# Altium project LimeSDR-XTRX_1v4.PrjPcb (part 4 of 8)

## Sheet 08_FPGA.SchDoc: FPGA
size A3; Organization: Lime Microsystems; Address1: Surrey Tech Centre; Address2: Guildford GU2 7YG; Address3: Surrey; Address4: United Kingdom; Revision: v1.4; SheetNumber: 8; SheetTotal: 11
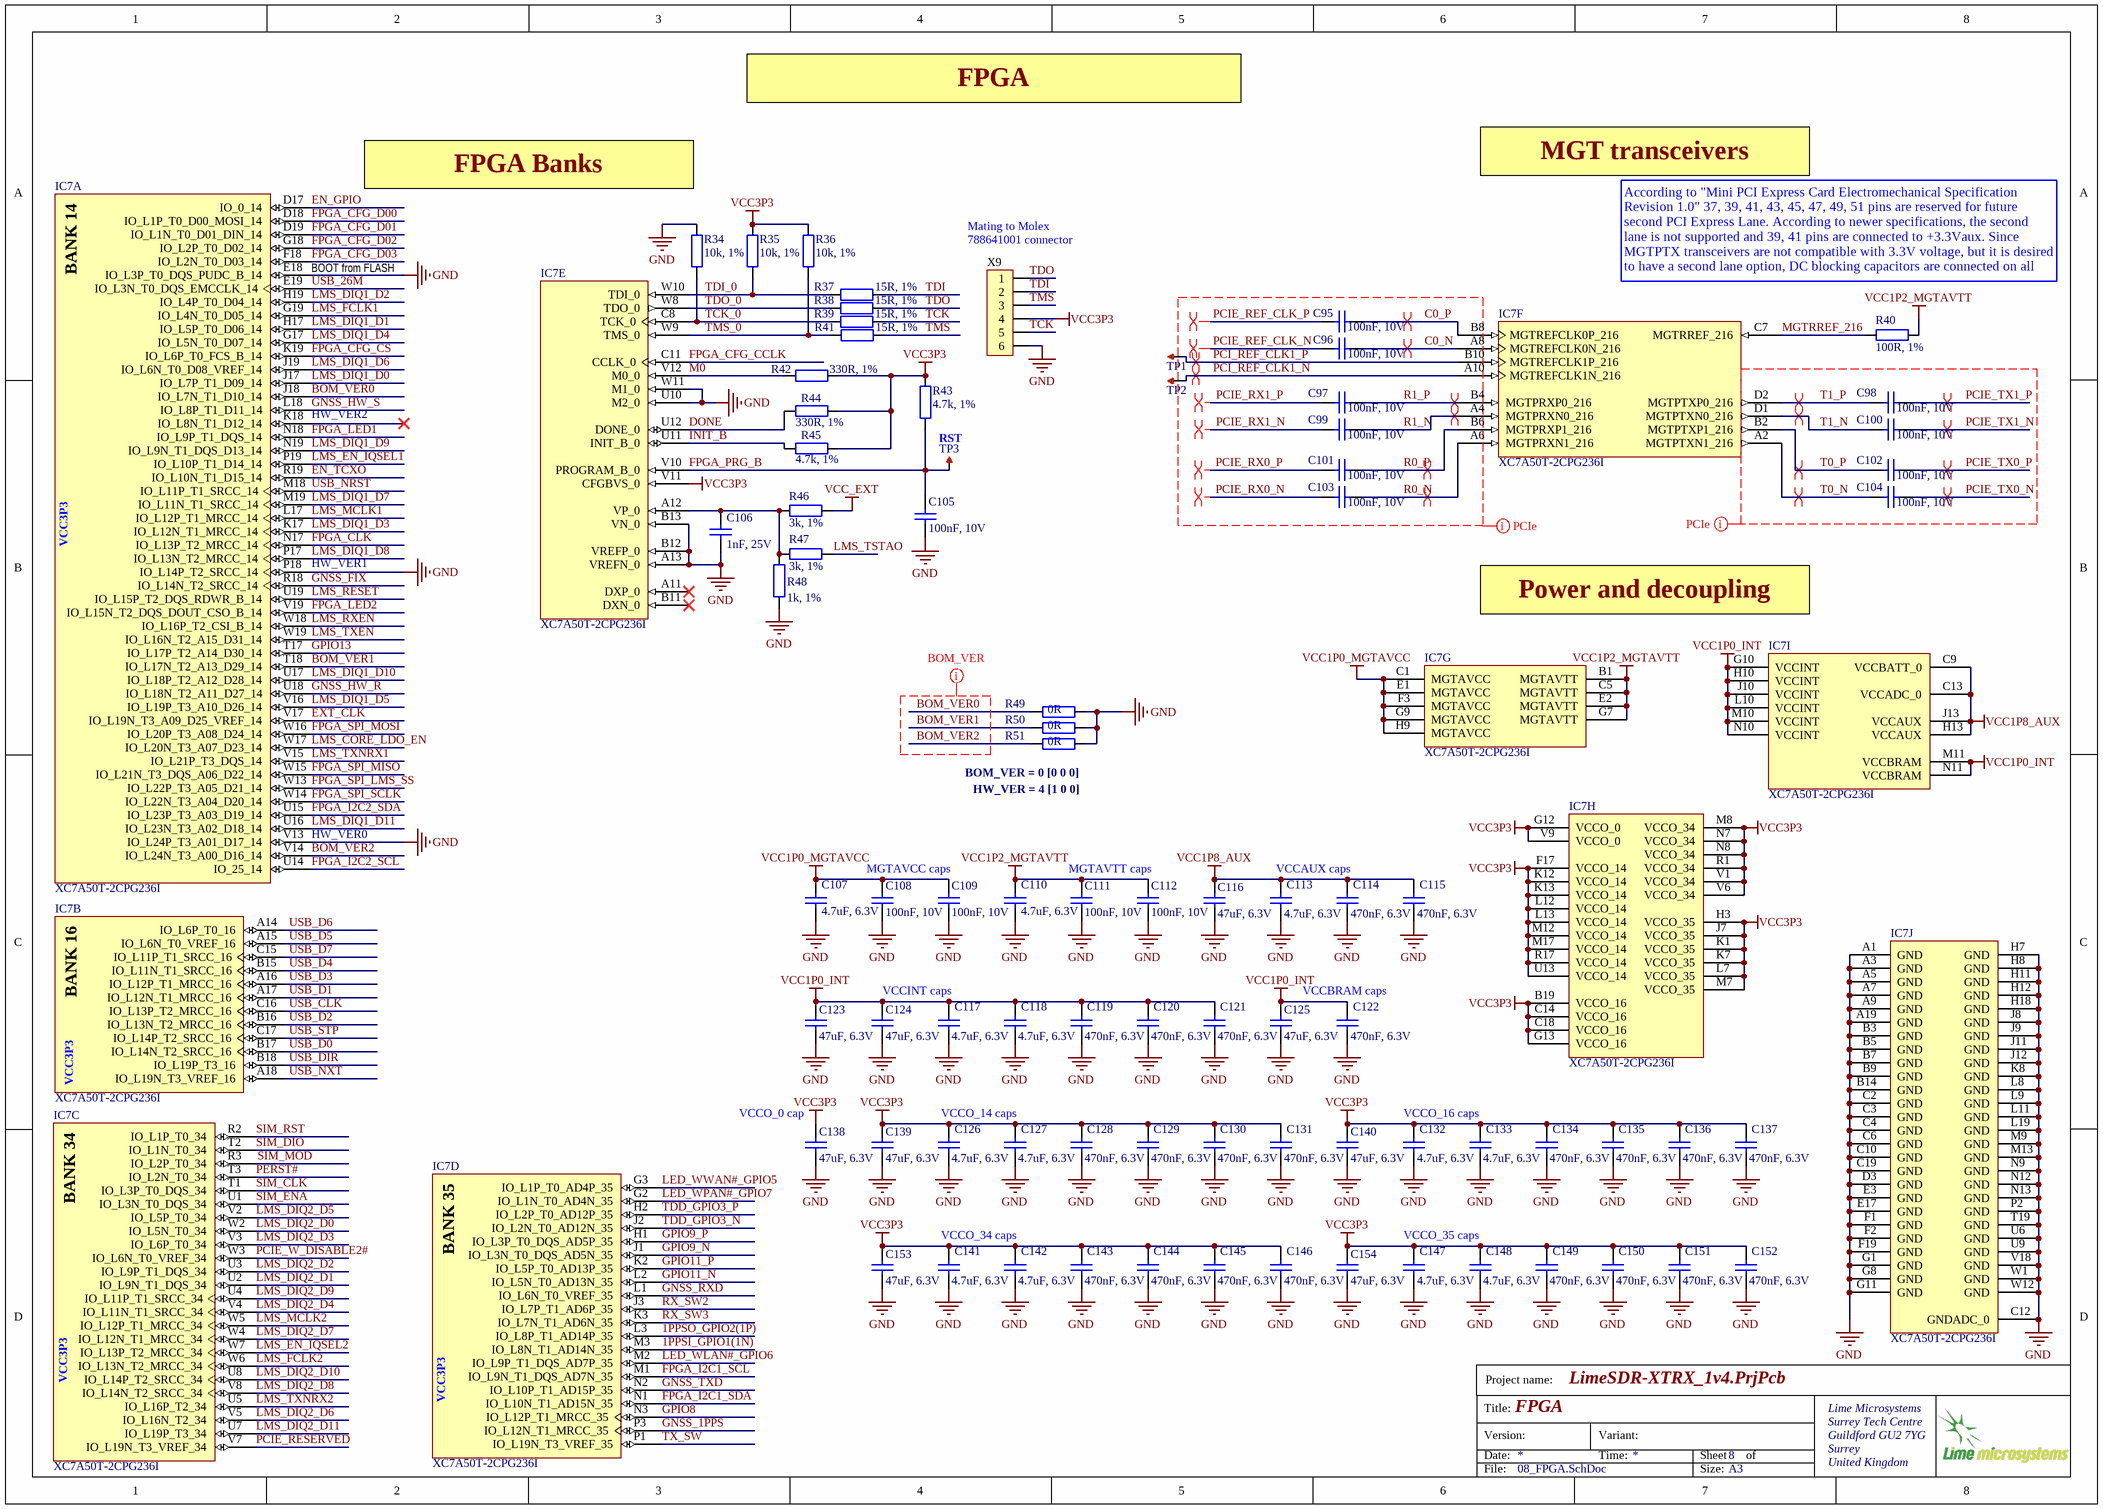
[diagram p7: 08_FPGA.SchDoc]

### Parts
C95  100nF, 10V  [CAP0201]
C96  100nF, 10V  [CAP0201]
C97  100nF, 10V  [CAP0201]
C98  100nF, 10V  [CAP0201]
C99  100nF, 10V  [CAP0201]
C100  100nF, 10V  [CAP0201]
C101  100nF, 10V  [CAP0201]
C102  100nF, 10V  [CAP0201]
C103  100nF, 10V  [CAP0201]
C104  100nF, 10V  [CAP0201]
C105  100nF, 10V  [CAP0201]
C106  1nF, 25V  [CAP0201]
C107  4.7uF, 6.3V  [CAP0402]
C108  100nF, 10V  [CAP0201]
C109  100nF, 10V  [CAP0201]
C110  4.7uF, 6.3V  [CAP0402]
C111  100nF, 10V  [CAP0201]
C112  100nF, 10V  [CAP0201]
C113  4.7uF, 6.3V  [CAP0402]
C114  470nF, 6.3V  [CAP0201]
C115  470nF, 6.3V  [CAP0201]
C116  47uF, 6.3V  [CAP0603]
C117  4.7uF, 6.3V  [CAP0402]
C118  4.7uF, 6.3V  [CAP0402]
C119  470nF, 6.3V  [CAP0201]
C120  470nF, 6.3V  [CAP0201]
C121  470nF, 6.3V  [CAP0201]
C122  470nF, 6.3V  [CAP0201]
C123  47uF, 6.3V  [CAP0603]
C124  47uF, 6.3V  [CAP0603]
C125  47uF, 6.3V  [CAP0603]
C126  4.7uF, 6.3V  [CAP0402]
C127  4.7uF, 6.3V  [CAP0402]
C128  470nF, 6.3V  [CAP0201]
C129  470nF, 6.3V  [CAP0201]
C130  470nF, 6.3V  [CAP0201]
C131  470nF, 6.3V  [CAP0201]
C132  4.7uF, 6.3V  [CAP0402]
C133  4.7uF, 6.3V  [CAP0402]
C134  470nF, 6.3V  [CAP0201]
C135  470nF, 6.3V  [CAP0201]
C136  470nF, 6.3V  [CAP0201]
C137  470nF, 6.3V  [CAP0201]
C138  47uF, 6.3V  [CAP0603]
C139  47uF, 6.3V  [CAP0603]
C140  47uF, 6.3V  [CAP0603]
C141  4.7uF, 6.3V  [CAP0402]
C142  4.7uF, 6.3V  [CAP0402]
C143  470nF, 6.3V  [CAP0201]
C144  470nF, 6.3V  [CAP0201]
C145  470nF, 6.3V  [CAP0201]
C146  470nF, 6.3V  [CAP0201]
C147  4.7uF, 6.3V  [CAP0402]
C148  4.7uF, 6.3V  [CAP0402]
C149  470nF, 6.3V  [CAP0201]
C150  470nF, 6.3V  [CAP0201]
C151  470nF, 6.3V  [CAP0201]
C152  470nF, 6.3V  [CAP0201]
C153  47uF, 6.3V  [CAP0603]
C154  47uF, 6.3V  [CAP0603]
IC7  XC7A50T-2CPG236I  [XC7A35T-2CPG236]  (parts A,B,C,D,E,F,G,H,I,J of 10)
R34  10k, 1%  [RES0201]
R35  10k, 1%  [RES0201]
R36  10k, 1%  [RES0201]
R37  15R, 1%  [RES0201]
R38  15R, 1%  [RES0201]
R39  15R, 1%  [RES0201]
R40  100R, 1%  [RES0201]
R41  15R, 1%  [RES0201]
R42  330R, 1%  [RES0201]
R43  4.7k, 1%  [RES0201]
R44  330R, 1%  [RES0201]
R45  4.7k, 1%  [RES0201]
R46  3k, 1%  [RES0201]
R47  3k, 1%  [RES0201]
R48  1k, 1%  [RES0201]
R49  0R  [RES0201]
R50  0R  [RES0201]
R51  0R  [RES0201]
TP1  TESTPOINT_PAD  [TP_PAD_1MM]  (value not drawn)  (no BOM)
TP2  TESTPOINT_PAD  [TP_PAD_1MM]  (value not drawn)  (no BOM)
TP3  TESTPOINT_PAD  [TP_PAD_1MM]  (value not drawn)  (no BOM)
X9  Molex 0788641001  [Molex_0788641001_spring_contacts]  (value not drawn)

### Nets
GND: C105.2 C106.2 C107.1 C108.2 C109.2 C110.1 C111.2 C112.2 C113.1 C114.2 C115.2 C116.1 C117.1 C118.1 C119.2 C120.2 C121.2 C122.2 C123.1 C124.1 C125.1 C126.1 C127.1 C128.2 C129.2 C130.2 C131.2 C132.1 C133.1 C134.2 C135.2 C136.2 C137.2 C138.1 C139.1 C140.1 C141.1 C142.1 C143.2 C144.2 C145.2 C146.2 C147.1 C148.1 C149.2 C150.2 C151.2 C152.2 C153.1 C154.1 IC7.A1(GND) IC7.A3(GND) IC7.A5(GND) IC7.A7(GND) IC7.A9(GND) IC7.A13(VREFN_0) IC7.A19(GND) IC7.B3(GND) IC7.B5(GND) IC7.B7(GND) IC7.B9(GND) IC7.B12(VREFP_0) IC7.B13(VN_0) IC7.B14(GND) IC7.C2(GND) IC7.C3(GND) IC7.C4(GND) IC7.C6(GND) IC7.C10(GND) IC7.C12(GNDADC_0) IC7.C19(GND) IC7.D3(GND) IC7.E3(GND) IC7.E17(GND) IC7.E18(IO_L3P_T0_DQS_PUDC_B_14) IC7.F1(GND) IC7.F2(GND) IC7.F19(GND) IC7.G1(GND) IC7.G8(GND) IC7.G11(GND) IC7.H7(GND) IC7.H8(GND) IC7.H11(GND) IC7.H12(GND) IC7.H18(GND) IC7.J8(GND) IC7.J9(GND) IC7.J11(GND) IC7.J12(GND) IC7.K8(GND) IC7.L8(GND) IC7.L9(GND) IC7.L11(GND) IC7.L19(GND) IC7.M9(GND) IC7.M13(GND) IC7.N9(GND) IC7.N12(GND) IC7.N13(GND) IC7.P2(GND) IC7.P18(IO_L14P_T2_SRCC_14) IC7.T19(GND) IC7.U6(GND) IC7.U9(GND) IC7.U10(M2_0) IC7.V13(IO_L24P_T3_A01_D17_14) IC7.V18(GND) IC7.W1(GND) IC7.W11(M1_0) IC7.W12(GND) R34.1 R48.2 R49.1 R50.1 R51.1 X9.6
VCC1P0_INT: C117.2 C118.2 C119.1 C120.1 C121.1 C122.1 C123.2 C124.2 C125.2 IC7.G10(VCCINT) IC7.H10(VCCINT) IC7.J10(VCCINT) IC7.L10(VCCINT) IC7.M10(VCCINT) IC7.M11(VCCBRAM) IC7.N10(VCCINT) IC7.N11(VCCBRAM)
VCC1P0_MGTAVCC: C107.2 C108.1 C109.1 IC7.C1(MGTAVCC) IC7.E1(MGTAVCC) IC7.F3(MGTAVCC) IC7.G9(MGTAVCC) IC7.H9(MGTAVCC)
VCC1P2_MGTAVTT: C110.2 C111.1 C112.1 IC7.B1(MGTAVTT) IC7.C5(MGTAVTT) IC7.E2(MGTAVTT) IC7.G7(MGTAVTT) R40.1
VCC1P8_AUX: C113.2 C114.1 C115.1 C116.2 IC7.C9(VCCBATT_0) IC7.C13(VCCADC_0) IC7.H13(VCCAUX) IC7.J13(VCCAUX)
VCC3P3: C126.2 C127.2 C128.1 C129.1 C130.1 C131.1 C132.2 C133.2 C134.1 C135.1 C136.1 C137.1 C138.2 C139.2 C140.2 C141.2 C142.2 C143.1 C144.1 C145.1 C146.1 C147.2 C148.2 C149.1 C150.1 C151.1 C152.1 C153.2 C154.2 IC7.B19(VCCO_16) IC7.C14(VCCO_16) IC7.C18(VCCO_16) IC7.F17(VCCO_14) IC7.G12(VCCO_0) IC7.G13(VCCO_16) IC7.H3(VCCO_35) IC7.J7(VCCO_35) IC7.K1(VCCO_35) IC7.K7(VCCO_35) IC7.K12(VCCO_14) IC7.K13(VCCO_14) IC7.L7(VCCO_35) IC7.L12(VCCO_14) IC7.L13(VCCO_14) IC7.M7(VCCO_35) IC7.M8(VCCO_34) IC7.M12(VCCO_14) IC7.M17(VCCO_14) IC7.N7(VCCO_34) IC7.N8(VCCO_34) IC7.R1(VCCO_34) IC7.R17(VCCO_14) IC7.U13(VCCO_14) IC7.V1(VCCO_34) IC7.V6(VCCO_34) IC7.V9(VCCO_0) IC7.V11(CFGBVS_0) R35.1 R36.1 R42.1 R43.1 R44.1 R45.1 X9.4
VCC_EXT: R46.2
1PPSI_GPIO1(1N): IC7.M3(IO_L8N_T1_AD14N_35)
1PPSO_GPIO2(1P): IC7.L3(IO_L8P_T1_AD14P_35)
BOM_VER0: IC7.J18(IO_L7N_T1_D10_14) R49.2
BOM_VER1: IC7.T18(IO_L17N_T2_A13_D29_14) R50.2
BOM_VER2: IC7.V14(IO_L24N_T3_A00_D16_14) R51.2
C0_N: C96.2 IC7.A8(MGTREFCLK0N_216)
C0_P: C95.2 IC7.B8(MGTREFCLK0P_216)
DONE: IC7.U12(DONE_0) R44.2
EN_GPIO: IC7.D17(IO_0_14)
EN_TCXO: IC7.R19(IO_L10N_T1_D15_14)
EXT_CLK: IC7.V17(IO_L19N_T3_A09_D25_VREF_14)
FPGA_CFG_CCLK: IC7.C11(CCLK_0)
FPGA_CFG_CS: IC7.K19(IO_L6P_T0_FCS_B_14)
FPGA_CFG_D00: IC7.D18(IO_L1P_T0_D00_MOSI_14)
FPGA_CFG_D01: IC7.D19(IO_L1N_T0_D01_DIN_14)
FPGA_CFG_D02: IC7.G18(IO_L2P_T0_D02_14)
FPGA_CFG_D03: IC7.F18(IO_L2N_T0_D03_14)
FPGA_CLK: IC7.N17(IO_L13P_T2_MRCC_14)
FPGA_I2C1_SCL: IC7.M1(IO_L9N_T1_DQS_AD7N_35)
FPGA_I2C1_SDA: IC7.N1(IO_L10N_T1_AD15N_35)
FPGA_I2C2_SCL: IC7.U14(IO_25_14)
FPGA_I2C2_SDA: IC7.U15(IO_L23P_T3_A03_D19_14)
FPGA_LED1: IC7.N18(IO_L9P_T1_DQS_14)
FPGA_LED2: IC7.V19(IO_L15N_T2_DQS_DOUT_CSO_B_14)
FPGA_PRG_B: C105.1 IC7.V10(PROGRAM_B_0) R43.2 TP3.1
FPGA_SPI_LMS_SS: IC7.W13(IO_L22P_T3_A05_D21_14)
FPGA_SPI_MISO: IC7.W15(IO_L21N_T3_DQS_A06_D22_14)
FPGA_SPI_MOSI: IC7.W16(IO_L20P_T3_A08_D24_14)
FPGA_SPI_SCLK: IC7.W14(IO_L22N_T3_A04_D20_14)
GNSS_1PPS: IC7.P3(IO_L12N_T1_MRCC_35)
GNSS_FIX: IC7.R18(IO_L14N_T2_SRCC_14)
GNSS_HW_R: IC7.U18(IO_L18N_T2_A11_D27_14)
GNSS_HW_S: IC7.L18(IO_L8P_T1_D11_14)
GNSS_RXD: IC7.L1(IO_L6N_T0_VREF_35)
GNSS_TXD: IC7.N2(IO_L10P_T1_AD15P_35)
GPIO8: IC7.N3(IO_L12P_T1_MRCC_35)
GPIO9_N: IC7.J1(IO_L3N_T0_DQS_AD5N_35)
GPIO9_P: IC7.H1(IO_L3P_T0_DQS_AD5P_35)
GPIO11_N: IC7.L2(IO_L5N_T0_AD13N_35)
GPIO11_P: IC7.K2(IO_L5P_T0_AD13P_35)
GPIO13: IC7.T17(IO_L17P_T2_A14_D30_14)
INIT_B: IC7.U11(INIT_B_0) R45.2
LED_WLAN#_GPIO6: IC7.M2(IO_L9P_T1_DQS_AD7P_35)
LED_WPAN#_GPIO7: IC7.G2(IO_L1N_T0_AD4N_35)
LED_WWAN#_GPIO5: IC7.G3(IO_L1P_T0_AD4P_35)
LMS_CORE_LDO_EN: IC7.W17(IO_L20N_T3_A07_D23_14)
LMS_DIQ1_D0: IC7.J17(IO_L7P_T1_D09_14)
LMS_DIQ1_D1: IC7.H17(IO_L5P_T0_D06_14)
LMS_DIQ1_D2: IC7.H19(IO_L4P_T0_D04_14)
LMS_DIQ1_D3: IC7.K17(IO_L12N_T1_MRCC_14)
LMS_DIQ1_D4: IC7.G17(IO_L5N_T0_D07_14)
LMS_DIQ1_D5: IC7.V16(IO_L19P_T3_A10_D26_14)
LMS_DIQ1_D6: IC7.J19(IO_L6N_T0_D08_VREF_14)
LMS_DIQ1_D7: IC7.M19(IO_L11N_T1_SRCC_14)
LMS_DIQ1_D8: IC7.P17(IO_L13N_T2_MRCC_14)
LMS_DIQ1_D9: IC7.N19(IO_L9N_T1_DQS_D13_14)
LMS_DIQ1_D10: IC7.U17(IO_L18P_T2_A12_D28_14)
LMS_DIQ1_D11: IC7.U16(IO_L23N_T3_A02_D18_14)
LMS_DIQ2_D0: IC7.W2(IO_L5N_T0_34)
LMS_DIQ2_D1: IC7.U2(IO_L9N_T1_DQS_34)
LMS_DIQ2_D2: IC7.U3(IO_L9P_T1_DQS_34)
LMS_DIQ2_D3: IC7.V3(IO_L6P_T0_34)
LMS_DIQ2_D4: IC7.V4(IO_L11N_T1_SRCC_34)
LMS_DIQ2_D5: IC7.V2(IO_L5P_T0_34)
LMS_DIQ2_D6: IC7.V5(IO_L16N_T2_34)
LMS_DIQ2_D7: IC7.W4(IO_L12N_T1_MRCC_34)
LMS_DIQ2_D8: IC7.V8(IO_L14N_T2_SRCC_34)
LMS_DIQ2_D9: IC7.U4(IO_L11P_T1_SRCC_34)
LMS_DIQ2_D10: IC7.U8(IO_L14P_T2_SRCC_34)
LMS_DIQ2_D11: IC7.U7(IO_L19P_T3_34)
LMS_EN_IQSEL1: IC7.P19(IO_L10P_T1_D14_14)
LMS_EN_IQSEL2: IC7.W7(IO_L13P_T2_MRCC_34)
LMS_FCLK1: IC7.G19(IO_L4N_T0_D05_14)
LMS_FCLK2: IC7.W6(IO_L13N_T2_MRCC_34)
LMS_MCLK1: IC7.L17(IO_L12P_T1_MRCC_14)
LMS_MCLK2: IC7.W5(IO_L12P_T1_MRCC_34)
LMS_RESET: IC7.U19(IO_L15P_T2_DQS_RDWR_B_14)
LMS_RXEN: IC7.W18(IO_L16P_T2_CSI_B_14)
LMS_TSTAO: R47.2
LMS_TXEN: IC7.W19(IO_L16N_T2_A15_D31_14)
LMS_TXNRX1: IC7.V15(IO_L21P_T3_DQS_14)
LMS_TXNRX2: IC7.U5(IO_L16P_T2_34)
M0: IC7.V12(M0_0) R42.2
MGTRREF_216: IC7.C7(MGTRREF_216) R40.2
PCI_REF_CLK1_N: IC7.A10(MGTREFCLK1N_216) TP2.1
PCI_REF_CLK1_P: IC7.B10(MGTREFCLK1P_216) TP1.1
PCIE_REF_CLK_N: C96.1
PCIE_REF_CLK_P: C95.1
PCIE_RESERVED: IC7.V7(IO_L19N_T3_VREF_34)
PCIE_RX0_N: C103.1
PCIE_RX0_P: C101.1
PCIE_RX1_N: C99.1
PCIE_RX1_P: C97.1
PCIE_TX0_N: C104.2
PCIE_TX0_P: C102.2
PCIE_TX1_N: C100.2
PCIE_TX1_P: C98.2
PCIE_W_DISABLE2#: IC7.W3(IO_L6N_T0_VREF_34)
PERST#: IC7.T3(IO_L2N_T0_34)
R0_N: C103.2 IC7.A6(MGTPRXN1_216)
R0_P: C101.2 IC7.B6(MGTPRXP1_216)
R1_N: C99.2 IC7.A4(MGTPRXN0_216)
R1_P: C97.2 IC7.B4(MGTPRXP0_216)
RX_SW2: IC7.J3(IO_L7P_T1_AD6P_35)
RX_SW3: IC7.K3(IO_L7N_T1_AD6N_35)
SIM_CLK: IC7.T1(IO_L3P_T0_DQS_34)
SIM_DIO: IC7.T2(IO_L1N_T0_34)
SIM_ENA: IC7.U1(IO_L3N_T0_DQS_34)
SIM_MOD: IC7.R3(IO_L2P_T0_34)
SIM_RST: IC7.R2(IO_L1P_T0_34)
T0_N: C104.1 IC7.A2(MGTPTXN1_216)
T0_P: C102.1 IC7.B2(MGTPTXP1_216)
T1_N: C100.1 IC7.D1(MGTPTXN0_216)
T1_P: C98.1 IC7.D2(MGTPTXP0_216)
TCK: R39.1 X9.5
TCK_0: IC7.C8(TCK_0) R34.2 R39.2
TDD_GPIO3_N: IC7.J2(IO_L2N_T0_AD12N_35)
TDD_GPIO3_P: IC7.H2(IO_L2P_T0_AD12P_35)
TDI: R37.1 X9.2
TDI_0: IC7.W10(TDI_0) R35.2 R37.2
TDO: R38.1 X9.1
TDO_0: IC7.W8(TDO_0) R38.2
TMS: R41.1 X9.3
TMS_0: IC7.W9(TMS_0) R36.2 R41.2
TX_SW: IC7.P1(IO_L19N_T3_VREF_35)
USB_26M: IC7.E19(IO_L3N_T0_DQS_EMCCLK_14)
USB_CLK: IC7.C16(IO_L13P_T2_MRCC_16)
USB_D0: IC7.B17(IO_L14N_T2_SRCC_16)
USB_D1: IC7.A17(IO_L12N_T1_MRCC_16)
USB_D2: IC7.B16(IO_L13N_T2_MRCC_16)
USB_D3: IC7.A16(IO_L12P_T1_MRCC_16)
USB_D4: IC7.B15(IO_L11N_T1_SRCC_16)
USB_D5: IC7.A15(IO_L6N_T0_VREF_16)
USB_D6: IC7.A14(IO_L6P_T0_16)
USB_D7: IC7.C15(IO_L11P_T1_SRCC_16)
USB_DIR: IC7.B18(IO_L19P_T3_16)
USB_NRST: IC7.M18(IO_L11P_T1_SRCC_14)
USB_NXT: IC7.A18(IO_L19N_T3_VREF_16)
USB_STP: IC7.C17(IO_L14P_T2_SRCC_16)
NetC106_1: C106.1 IC7.A12(VP_0) R46.1 R47.1 R48.1

Not connected (* = marked no-connect by the designer): IC7 A11(DXP_0)* B11(DXN_0)* K18(IO_L8N_T1_D12_14)*

### Layout directives
differential pair: C0_N, C0_P, PCI_REF_CLK1_N, PCI_REF_CLK1_P, PCIE_REF_CLK_N, PCIE_REF_CLK_P, PCIE_RX0_N, PCIE_RX0_P, PCIE_RX1_N, PCIE_RX1_P, PCIE_TX0_N, PCIE_TX0_P, PCIE_TX1_N, PCIE_TX1_P, R0_N, R0_P, R1_N, R1_P, T0_N, T0_P, T1_N, T1_P
net class PCIe: C0_N, C0_P, PCI_REF_CLK1_N, PCI_REF_CLK1_P, PCIE_REF_CLK_N, PCIE_REF_CLK_P, PCIE_RX0_N, PCIE_RX0_P, PCIE_RX1_N, PCIE_RX1_P, PCIE_TX0_N, PCIE_TX0_P, PCIE_TX1_N, PCIE_TX1_P, R0_N, R0_P, R1_N, R1_P, T0_N, T0_P, T1_N, T1_P
net class BOM_VER: BOM_VER0, BOM_VER1, BOM_VER2

### Notes on the sheet
- FPGA
- MGT transceivers
- (near R34) FPGA Banks
- (near X9) Mating to Molex 788641001 connector
- (near IC7) BOOT from FLASH
- According to "Mini PCI Express Card Electromechanical Specification Revision 1.0" 37, 39, 41, 43, 45, 47, 49, 51 pins are reserved for future second PCI Express Lane. According to newer specifications, the second lane is not supported and 39, 41 pins are connected to +3.3Vaux. Since MGTPTX transceivers are not compatible with 3.3V voltage, but it is desired to have a second lane option, DC blocking capacitors are connected on all TX lines.
- (near IC7) HW_VER2
- RST
- VCC3P3
- (near IC7) HW_VER1
- (near IC7) Power and decoupling
- (near R51) BOM_VER = 0 [0 0 0]
- (near IC7) HW_VER0
- HW_VER = 4 [1 0 0]
- MGTAVCC caps
- MGTAVTT caps
- VCCAUX caps
- VCCINT caps
- VCCBRAM caps
- (near C138) VCCO_0 cap
- VCCO_14 caps
- VCCO_16 caps
- VCCO_34 caps
- VCCO_35 caps
- Project name:
- Title:
- Version:
- Date:
- Variant:
- Time:
- Sheet
- of
- File:
- Size:
- A3
- (in symbol XC7A35T-2CPG236, part A) BANK 14
- (in symbol XC7A35T-2CPG236, part B) BANK 16
- (in symbol XC7A35T-2CPG236, part C) BANK 34
- (in symbol XC7A35T-2CPG236, part D) BANK 35

### Library data of the parts
C95-C97 C99 C101 C103 C105 C108 C109 C111 C112 = Cap_0402: Part Description: 0.1 µF ±20% 10V Ceramic Capacitor X5R 0201 (0603 Metric); Manufacturer: Samsung; Manufacturer Part Number 1: CL03A104MP3NNNC; Tolerance: 20%; Value: 100nF, 10V; Capacitance: 100nF; Case/Package: 0201; Case Code (Imperial): 0201; Case Code (Metric): 0603; ComponentLink5Description: https://datasheet.ciiva.com/25788/cl03a104mp3nnnc-25788272.pdf?src-supplier=Digi-Key; ComponentLink5URL: https://datasheet.ciiva.com/25788/cl03a104mp3nnnc-25788272.pdf?src-supplier=Digi-Key; Length: 0.024inch; Max Operating Temperature: 85°C; Min Operating Temperature: -55°C; Mount: Surface Mount; Package Quantity: 1; Packaging: Tape and Reel; Pricing 1: 1=0,10000, 10=0,03000, 50=0,01640, 100=0,01330, 500=0,00950, 1000=0,00747, 2500=0,00679, 5000=0,00625 (USD); RoHS: Yes; RoHS Compliant: Yes; Series: CL; Stock 1: 3817176; Supplier 1: Digi-Key; Supplier Part Number 1: 1276-1321-1-ND; Thickness: 0.013inch; Voltage Rating (DC): 10V; Voltage Rating: 10V; Width: 0.012inch
C98 C100 C102 C104 = Cap_0402: Manufacturer: Samsung; Manufacturer Part Number 1: CL03A104MP3NNNC; Part Description: 0.1 µF ±20% 10V Ceramic Capacitor X5R 0201 (0603 Metric); Tolerance: 20%; ComponentLink5Description: https://datasheet.ciiva.com/25788/cl03a104mp3nnnc-25788272.pdf?src-supplier=Digi-Key; ComponentLink5URL: https://datasheet.ciiva.com/25788/cl03a104mp3nnnc-25788272.pdf?src-supplier=Digi-Key; Capacitance: 100nF; Case/Package: 0201; Case Code (Imperial): 0201; Case Code (Metric): 0603; Length: 0.024inch; Max Operating Temperature: 85°C; Min Operating Temperature: -55°C; Mount: Surface Mount; Package Quantity: 1; Packaging: Tape and Reel; Pricing 1: 1=0,10000, 10=0,03000, 50=0,01640, 100=0,01330, 500=0,00950, 1000=0,00747, 2500=0,00679, 5000=0,00625 (USD); RoHS: Yes; RoHS Compliant: Yes; Series: CL; Stock 1: 3817176; Supplier 1: Digi-Key; Supplier Part Number 1: 1276-1321-1-ND; Thickness: 0.013inch; Value: 100nF, 10V; Voltage Rating (DC): 10V; Voltage Rating: 10V; Width: 0.012inch
C106 = Cap_0402: Manufacturer Part Number 1: C0603X7R1E102K030BA; Manufacturer: TDK Corporation; Part Description: 1000pF ±10% 25V X7R Ceramic Capacitor -55°C ~ 125°C Surface Mount, MLCC 0201 (0603 Metric) 0.024" L x 0.012" W (0.60mm x 0.30mm); Temperature Coefficient: X7R; Tolerance: ±10%; Capacitance: 1000pF; Value: 1nF, 25V; Supplier 1: Digi-Key; Supplier Part Number 1: 445-7275-1-ND; Voltage - Rated: 25V; Features: -; Package / Case: 0201 (0603 Metric); Lead Spacing: -; Mounting Type: Surface Mount, MLCC; Lead Style: -; Height - Seated (Max): -; Operating Temperature: -55°C ~ 125°C; Size / Dimension: 0.024" L x 0.012" W (0.60mm x 0.30mm); Applications: General Purpose; Ratings: -; Thickness (Max): 0.013" (0.33mm); RoHS: RoHS Compliant; Packaging: Cut Tape (CT); Category: Capacitors
C107 C110 C113 C117 C118 C126 C127 C132 C133 C141 C142 C147 C148 = Cap_0402: Manufacturer: Murata Electronics North America; Manufacturer Part Number 1: GRM155R60J475ME87D; Part Description: 4.7µF ±20% 6.3V X5R Ceramic Capacitor -55°C ~ 85°C Surface Mount, MLCC 0402 (1005 Metric) 0.039" L x 0.020" W (1.00mm x 0.50mm); Tolerance: ±20%; Capacitance: 4.7µF; Temperature Coefficient: X5R; Lead Style: -; Ratings: -; Height - Seated (Max): -; Thickness (Max): 0.022" (0.55mm); Voltage - Rated: 6.3V; Packaging: Cut Tape (CT); Lead Spacing: -; Category: Capacitors; Supplier Part Number 1: 490-5408-1-ND; Applications: General Purpose; Operating Temperature: -55°C ~ 85°C; Mounting Type: Surface Mount, MLCC; Features: Derating Recommended; RoHS: RoHS Compliant; Supplier 1: Digi-Key; Package / Case: 0402 (1005 Metric); Size / Dimension: 0.039" L x 0.020" W (1.00mm x 0.50mm); Value: 4.7uF, 6.3V
C114 C115 C119-C122 C128-C131 C134-C137 C143-C146 C149-C152 = Cap_0402: Manufacturer: Murata; Manufacturer Part Number 1: GRM033R60J474KE90D; Part Description: 0.47 µF ±10% 6.3V Ceramic Capacitor X5R 0201 (0603 Metric); Tolerance: 10%; Dielectric: X5R; Value: 470nF, 6.3V; Supplier 1: Digi-Key; Supplier Part Number 1: 490-10409-1-ND; Stock 1: 1562532; Pricing 1: 1=0,10000, 10=0,06000, 50=0,03280, 100=0,02670, 500=0,01908, 1000=0,01500, 2500=0,01364, 5000=0,01254 (USD); RoHS: Yes; Mount: Surface Mount; Case/Package: 0201; Case Code (Metric): 0603; Case Code (Imperial): 0201; Weight: 1.2E-05oz; Min Operating Temperature: -55°C; Max Operating Temperature: 85°C; Packaging: Tape and Reel; Capacitance: 470nF; Voltage Rating: 6.3V; Termination: SMD/SMT; Voltage Rating (DC): 6.3V; Package Quantity: 15000; Length: 0.6mm; Width: 0.012inch; Height: 0.3mm; Thickness: 0.013inch; Depth: 0.3mm; Lead Free: Lead Free; RoHS Compliant: Yes; ComponentLink1URL: http://www.farnell.com/datasheets/2867834.pdf?src-supplier=Farnell; ComponentLink1Description: http://www.farnell.com/datasheets/2867834.pdf?src-supplier=Farnell; ComponentLink2URL: http://www.mouser.com/ds/2/281/c02e-2905.pdf?src-supplier=Mouser; ComponentLink2Description: http://www.mouser.com/ds/2/281/c02e-2905.pdf?src-supplier=Mouser; ComponentLink3URL: http://www.farnell.com/datasheets/2867834.pdf?src-supplier=Element14; ComponentLink3Description: http://www.farnell.com/datasheets/2867834.pdf?src-supplier=Element14; ComponentLink4URL: http://search.murata.co.jp/Ceramy/image/img/A01X/G101/ENG/GRM033R60J474KE90-01.pdf?src-supplier=Digi-Key; ComponentLink4Description: http://search.murata.co.jp/Ceramy/image/img/A01X/G101/ENG/GRM033R60J474KE90-01.pdf?src-supplier=Digi-Key; ComponentLink5URL: http://www.farnell.com/datasheets/2867834.pdf?src-supplier=Newark; ComponentLink5Description: http://www.farnell.com/datasheets/2867834.pdf?src-supplier=Newark
C116 C123-C125 C138-C140 C153 C154 = Cap_0603: Part Description: 47 µF ±20% 6.3V Ceramic Capacitor X5R 0603 (1608 Metric); Manufacturer: Murata; Manufacturer Part Number 1: GRM188R60J476ME15D; Tolerance: 20%; Dielectric: X5R; Value: 47uF, 6.3V; Supplier 1: Digi-Key; Supplier Part Number 1: 490-13247-1-ND; Stock 1: 731453; Pricing 1: 1=0,45000, 10=0,31900, 50=0,24120, 100=0,21000, 500=0,15556, 1000=0,13223 (USD); RoHS: Yes; Mount: Surface Mount; Case/Package: 0603; Case Code (Metric): 1608; Case Code (Imperial): 0603; Min Operating Temperature: -55°C; Max Operating Temperature: 85°C; Packaging: Tape and Reel; Capacitance: 47uF; Voltage Rating: 6.3V; Voltage Rating (DC): 6.3V; Length: 0.063inch; Width: 0.031inch; Thickness: 0.039inch; RoHS Compliant: Yes; ComponentLink1URL: http://search.murata.co.jp/Ceramy/image/img/A01X/G101/ENG/GRM188R60J476ME15-01.pdf?src-supplier=Digi-Key; ComponentLink1Description: http://search.murata.co.jp/Ceramy/image/img/A01X/G101/ENG/GRM188R60J476ME15-01.pdf?src-supplier=Digi-Key; ComponentLink2URL: https://www.murata.com/~/media/webrenewal/support/library/catalog/products/capacitor/mlcc/c02e.ashx?la=en-us&src-supplier=Digi-Key; ComponentLink2Description: https://www.murata.com/~/media/webrenewal/support/library/catalog/products/capacitor/mlcc/c02e.ashx?la=en-us&src-supplier=Digi-Key
IC7 = XC7A35T-2CPG236: Artix-7 FPGA; Part Description: Artix-7 Field Programmable Gate Array (FPGA) IC 106 2764800 52160 238-LFBGA, CSPBGA; Manufacturer: Xilinx; Propagation Delay: 0.85ns; Speed Grade: 2; Number of Logic Blocks (LABs): 4075; Number of Logic Elements/Cells: 52160; RAM Size: 2764800b; Number of I/Os: 106; Number of Registers: 652; Min Supply Voltage: 950mV; Max Supply Voltage: 1.05V; ComponentLink1Description: Manufacturer URL; ComponentLink1URL: http://www.xilinx.com/; ComponentLink2Description: Datasheet; ComponentLink2URL: http://www.xilinx.com/support/documentation/data_sheets/ds180_7Series_Overview.pdf; ComponentLink3Description: Package Specification; ComponentLink3URL: http://www.xilinx.com/support/documentation/user_guides/ug475_7Series_Pkg_Pinout.pdf; ComponentLink4Description: DC and Switching Characteristics; ComponentLink4URL: http://www.xilinx.com/support/documentation/data_sheets/ds181_Artix_7_Data_Sheet.pdf; ComponentLink5Description: Package File; ComponentLink5URL: http://www.xilinx.com/support/packagefiles/a7packages/xc7a200tsbg484pkg.txt; ComponentLink6Description: Packaging and Pinout; ComponentLink6URL: http://www.xilinx.com/support/documentation/user_guides/ug475_7Series_Pkg_Pinout.pdf; ComponentLink7URL: http://www.farnell.com/datasheets/2553941.pdf?src-supplier=Farnell; ComponentLink7Description: http://www.farnell.com/datasheets/2553941.pdf?src-supplier=Farnell; ComponentLink8URL: http://www.xilinx.com/support/documentation/data_sheets/ds181_Artix_7_Data_Sheet.pdf?src-supplier=Avnet; ComponentLink8Description: http://www.xilinx.com/support/documentation/data_sheets/ds181_Artix_7_Data_Sheet.pdf?src-supplier=Avnet; ComponentLink9URL: https://www.xilinx.com/support/documentation/data_sheets/ds180_7Series_Overview.pdf?src-supplier=Digi-Key; ComponentLink9Description: https://www.xilinx.com/support/documentation/data_sheets/ds180_7Series_Overview.pdf?src-supplier=Digi-Key; Supplier 1: Digi-Key; Supplier Part Number 1: 122-2181-ND; Manufacturer Part Number 1: XC7A50T-2CPG236I; Stock 1: 0; RoHS: Yes; Mount: Surface Mount; Number of Pins: 236; Contact Plating: Copper,Tin,Silver; Min Operating Temperature: -40°C; Max Operating Temperature: 100°C; Turn-On Delay Time: 0.85ns; RoHS Compliant: Yes
R34-R36 = Res_0402: Manufacturer: Yageo; Manufacturer Part Number 1: RC0201FR-0710KL; Part Description: 10 kOhms ±1% 0.05W, 1/20W Chip Resistor 0201 (0603 Metric) Moisture Resistant Thick Film; Resistance: 10kR; Power Rating: 50mW; Voltage Rating: 25V; Temperature Coefficient: 200ppm/°C; Value: 10k, 1%; ComponentLink1URL: https://datasheet.ciiva.com/5924/1563626-5924912.pdf?src-supplier=Farnell; ComponentLink1Description: https://datasheet.ciiva.com/5924/1563626-5924912.pdf?src-supplier=Farnell; ComponentLink2URL: https://datasheet.ciiva.com/22661/1563626-22661319.pdf?src-supplier=Element14; ComponentLink2Description: https://datasheet.ciiva.com/22661/1563626-22661319.pdf?src-supplier=Element14; Supplier 1: Digi-Key; Supplier Part Number 1: 311-10.0KMCT-ND; Stock 1: 17142315; Pricing 1: 1=0,10000, 10=0,03700, 100=0,01530, 1000=0,00685, 2500=0,00595, 5000=0,00491 (USD); RoHS: Yes; Case/Package: 0201; Number of Pins: 2; Case Code (Imperial): 0201; Case Code (Metric): 0603; Contact Plating: Tin,Matte; Weight: 6E-06oz; Min Operating Temperature: -55°C; Max Operating Temperature: 125°C; Tolerance: 1%; Packaging: Tape and Reel; Package Quantity: 10000; Termination: SMD/SMT; Resistor Type: Thick Film; Number of Terminations: 2; Max Power Dissipation: 50mW; Voltage Rating (DC): 25V; Features: Moisture Resistant; Series: RC; Resistance Tolerance: 1%; Construction: Rectangular; Working Voltage: 25V; Technology: THICK FILM; Length: 0.6mm; Width: 0.012inch; Height: 0.01inch; Depth: 0.3mm; Radiation Hardening: No; Reach SVHC Compliant: Yes; Military Standard: Not; Lead Free: Lead Free; RoHS Compliant: Yes; ComponentLink3URL: https://datasheet.ciiva.com/7660/1421516-7660807.pdf?src-supplier=Element14; ComponentLink3Description: https://datasheet.ciiva.com/7660/1421516-7660807.pdf?src-supplier=Element14; ComponentLink4URL: https://datasheet.ciiva.com/46391/1421516-46391339.pdf?src-supplier=Element14; ComponentLink4Description: https://datasheet.ciiva.com/46391/1421516-46391339.pdf?src-supplier=Element14; ComponentLink5URL: https://datasheet.ciiva.com/2467/pyu-r-int-thick-7-2467110.pdf?src-supplier=Digi-Key; ComponentLink5Description: https://datasheet.ciiva.com/2467/pyu-r-int-thick-7-2467110.pdf?src-supplier=Digi-Key; ComponentLink6URL: https://datasheet.ciiva.com/2467/pyu-r-int-thick-7-2467111.pdf?src-supplier=Digi-Key; ComponentLink6Description: https://datasheet.ciiva.com/2467/pyu-r-int-thick-7-2467111.pdf?src-supplier=Digi-Key; ComponentLink7URL: https://datasheet.ciiva.com/2467/pyu-r-int-thick-7-2467109.pdf?src-supplier=Digi-Key; ComponentLink7Description: https://datasheet.ciiva.com/2467/pyu-r-int-thick-7-2467109.pdf?src-supplier=Digi-Key
R37-R39 R41 = Res_0402: Manufacturer: Yageo; Manufacturer Part Number 1: RC0201FR-0715RL; Part Description: 15 Ohms ±1% 0.05W, 1/20W Chip Resistor 0201 (0603 Metric) Moisture Resistant Thick Film; Power Rating: 50mW; Voltage Rating: 25V; Temperature Coefficient: 200ppm/°C; Value: 15R, 1%; ComponentLink1URL: https://datasheet.ciiva.com/5924/1563626-5924912.pdf?src-supplier=Farnell; ComponentLink1Description: https://datasheet.ciiva.com/5924/1563626-5924912.pdf?src-supplier=Farnell; ComponentLink2URL: https://datasheet.ciiva.com/22661/1563626-22661319.pdf?src-supplier=Element14; ComponentLink2Description: https://datasheet.ciiva.com/22661/1563626-22661319.pdf?src-supplier=Element14; Supplier 1: Digi-Key; Supplier Part Number 1: 311-15.0MCT-ND; Stock 1: 379739; Pricing 1: 1=0,10000, 10=0,03700, 100=0,01530, 1000=0,00685, 2500=0,00595, 5000=0,00491 (USD); RoHS: Yes; Case/Package: 0201; Case Code (Imperial): 0201; Case Code (Metric): 0603; Size Code: 0201; Min Operating Temperature: -55°C; Max Operating Temperature: 125°C; Resistance: 15R; Tolerance: 1%; Packaging: Cut Tape; Package Quantity: 1; Termination: SMD/SMT; Resistor Type: Thick Film; Number of Terminations: 2; Max Power Dissipation: 50mW; Features: Moisture Resistant; Series: RC; Resistance Tolerance: 1%; Length: 0.6mm; Width: 0.3mm; Height: 0.23mm; Lead Free: Lead Free; RoHS Compliant: Yes; ComponentLink3URL: https://datasheet.ciiva.com/7672/1563626-7672202.pdf?src-supplier=Element14; ComponentLink3Description: https://datasheet.ciiva.com/7672/1563626-7672202.pdf?src-supplier=Element14; ComponentLink4URL: https://datasheet.ciiva.com/2493/pyu-r-int-thick-7-2493785.pdf?src-supplier=Digi-Key; ComponentLink4Description: https://datasheet.ciiva.com/2493/pyu-r-int-thick-7-2493785.pdf?src-supplier=Digi-Key; ComponentLink5URL: https://datasheet.ciiva.com/2493/pyu-r-int-thick-7-2493786.pdf?src-supplier=Digi-Key; ComponentLink5Description: https://datasheet.ciiva.com/2493/pyu-r-int-thick-7-2493786.pdf?src-supplier=Digi-Key; ComponentLink6URL: https://datasheet.ciiva.com/2493/pyu-r-int-thick-7-2493784.pdf?src-supplier=Digi-Key; ComponentLink6Description: https://datasheet.ciiva.com/2493/pyu-r-int-thick-7-2493784.pdf?src-supplier=Digi-Key
R40 = Res_0402: Manufacturer: Yageo; Manufacturer Part Number 1: RC0201FR-07100RL; Part Description: 100 Ohms ±1% 0.05W, 1/20W Chip Resistor 0201 (0603 Metric) Moisture Resistant Thick Film; Power Rating: 50mW; Voltage Rating: 25V; Temperature Coefficient: 200ppm/°C; ComponentLink1URL: http://www.yageo.com/documents/recent/PYu-RC_Group_51_RoHS_L_7.pdf; ComponentLink1Description: http://www.yageo.com/documents/recent/PYu-RC_Group_51_RoHS_L_7.pdf; Value: 100R, 1%; Supplier 1: Digi-Key; Supplier Part Number 1: 311-100MCT-ND; Stock 1: 1625377; Pricing 1: 1=0,10000, 10=0,03700, 100=0,01530, 1000=0,00685, 2500=0,00595, 5000=0,00491 (USD); RoHS: Yes; Case/Package: 0201; Case Code (Metric): 0603; Case Code (Imperial): 0201; Contact Plating: Tin,Matte; Size Code: 0201; Min Operating Temperature: -55°C; Max Operating Temperature: 125°C; Resistance: 100R; Tolerance: 1%; Packaging: Cut Tape; Package Quantity: 1; Resistor Type: Thick Film; Number of Terminations: 2; Termination: SMD/SMT; Max Power Dissipation: 50mW; Features: Moisture Resistant; Series: RC; Resistance Tolerance: 1%; Length: 0.024inch; Width: 0.012inch; Height: 0.01inch; Radiation Hardening: No; Lead Free: Lead Free; RoHS Compliant: Yes; ComponentLink2URL: https://datasheet.ciiva.com/2560/pyu-r-int-thick-7-2560866.pdf?src-supplier=Digi-Key; ComponentLink2Description: https://datasheet.ciiva.com/2560/pyu-r-int-thick-7-2560866.pdf?src-supplier=Digi-Key; ComponentLink3URL: https://datasheet.ciiva.com/2560/pyu-r-int-thick-7-2560867.pdf?src-supplier=Digi-Key; ComponentLink3Description: https://datasheet.ciiva.com/2560/pyu-r-int-thick-7-2560867.pdf?src-supplier=Digi-Key; ComponentLink4URL: https://datasheet.ciiva.com/2560/pyu-r-int-thick-7-2560865.pdf?src-supplier=Digi-Key; ComponentLink4Description: https://datasheet.ciiva.com/2560/pyu-r-int-thick-7-2560865.pdf?src-supplier=Digi-Key; ComponentLink5URL: https://datasheet.ciiva.com/8887/pyu-rc0201-51-rohs-l-8-8887865.pdf?src-supplier=Avnet; ComponentLink5Description: https://datasheet.ciiva.com/8887/pyu-rc0201-51-rohs-l-8-8887865.pdf?src-supplier=Avnet
R42 R44 = Res_0402: Part Description: 330 Ohms ±1% 0.05W, 1/20W Chip Resistor 0201 (0603 Metric) Thick Film; Manufacturer: Vishay Dale; Manufacturer Part Number 1: CRCW0201330RFKED; Power Rating: 50mW; Voltage Rating: 30V; Temperature Coefficient: 100ppm/°C; Value: 330R, 1%; Supplier 1: Digi-Key; Supplier Part Number 1: 541-330AABCT-ND; Stock 1: 245078; Pricing 1: 1=0,27000, 10=0,23000, 100=0,08990, 1000=0,03762, 2500=0,03448, 5000=0,03135 (USD); RoHS: Yes; Case/Package: 0201; Weight: 6E-06oz; Case Code (Imperial): 0201; Case Code (Metric): 0603; Contact Plating: Tin; Size Code: 0201; Min Operating Temperature: -55°C; Max Operating Temperature: 155°C; Resistance: 330R; Tolerance: 1%; Packaging: Tape and Reel; Package Quantity: 1; Resistor Type: Thick Film; Number of Terminations: 2; Max Power Dissipation: 50mW; Series: CRCW; Construction: Rectangular; Length: 0.6mm; Width: 0.3mm; Height: 0.011inch; Depth: 0.3mm; Radiation Hardening: No; Military Standard: Not; Lead Free: Lead Free; RoHS Compliant: Yes; ComponentLink1URL: https://datasheet.ciiva.com/8944/crcw0201e3-8944937.pdf?src-supplier=Avnet; ComponentLink1Description: https://datasheet.ciiva.com/8944/crcw0201e3-8944937.pdf?src-supplier=Avnet; ComponentLink2URL: https://datasheet.ciiva.com/2473/crcw0201e3-2473436.pdf?src-supplier=Digi-Key; ComponentLink2Description: https://datasheet.ciiva.com/2473/crcw0201e3-2473436.pdf?src-supplier=Digi-Key; ComponentLink3URL: https://datasheet.ciiva.com/2473/crcw0201e3-2473437.pdf?src-supplier=Digi-Key; ComponentLink3Description: https://datasheet.ciiva.com/2473/crcw0201e3-2473437.pdf?src-supplier=Digi-Key; ComponentLink4URL: https://datasheet.ciiva.com/2473/crcw0201e3-2473438.pdf?src-supplier=Digi-Key; ComponentLink4Description: https://datasheet.ciiva.com/2473/crcw0201e3-2473438.pdf?src-supplier=Digi-Key; ComponentLink5URL: https://datasheet.ciiva.com/16394/dcrcwe3-16394575.pdf?src-supplier=Future+Electronics; ComponentLink5Description: https://datasheet.ciiva.com/16394/dcrcwe3-16394575.pdf?src-supplier=Future+Electronics
R43 R45 = Res_0402: Manufacturer: Yageo; Manufacturer Part Number 1: RC0201FR-074K7L; Part Description: 4.7 kOhms ±1% 0.05W, 1/20W Chip Resistor 0201 (0603 Metric) Moisture Resistant Thick Film; Resistance: 4.7kR; Power Rating: 50mW; Voltage Rating: 25V; Temperature Coefficient: 200ppm/°C; Value: 4.7k, 1%; ComponentLink1URL: https://datasheet.ciiva.com/5924/1563626-5924912.pdf?src-supplier=Farnell; ComponentLink1Description: https://datasheet.ciiva.com/5924/1563626-5924912.pdf?src-supplier=Farnell; ComponentLink2URL: https://datasheet.ciiva.com/22661/1563626-22661319.pdf?src-supplier=Element14; ComponentLink2Description: https://datasheet.ciiva.com/22661/1563626-22661319.pdf?src-supplier=Element14; ComponentLink3URL: https://datasheet.ciiva.com/7672/1563626-7672202.pdf?src-supplier=Element14; ComponentLink3Description: https://datasheet.ciiva.com/7672/1563626-7672202.pdf?src-supplier=Element14; ComponentLink4URL: https://datasheet.ciiva.com/2493/pyu-r-int-thick-7-2493785.pdf?src-supplier=Digi-Key; ComponentLink4Description: https://datasheet.ciiva.com/2493/pyu-r-int-thick-7-2493785.pdf?src-supplier=Digi-Key; ComponentLink5URL: https://datasheet.ciiva.com/2493/pyu-r-int-thick-7-2493786.pdf?src-supplier=Digi-Key; ComponentLink5Description: https://datasheet.ciiva.com/2493/pyu-r-int-thick-7-2493786.pdf?src-supplier=Digi-Key; ComponentLink6URL: https://datasheet.ciiva.com/2493/pyu-r-int-thick-7-2493784.pdf?src-supplier=Digi-Key; ComponentLink6Description: https://datasheet.ciiva.com/2493/pyu-r-int-thick-7-2493784.pdf?src-supplier=Digi-Key; ComponentLink7URL: https://datasheet.ciiva.com/7672/1563626-7672233.pdf?src-supplier=Element14; ComponentLink7Description: https://datasheet.ciiva.com/7672/1563626-7672233.pdf?src-supplier=Element14; ComponentLink8URL: https://datasheet.ciiva.com/2493/pyu-r-int-thick-7-2493812.pdf?src-supplier=Digi-Key; ComponentLink8Description: https://datasheet.ciiva.com/2493/pyu-r-int-thick-7-2493812.pdf?src-supplier=Digi-Key; ComponentLink9URL: https://datasheet.ciiva.com/2493/pyu-r-int-thick-7-2493813.pdf?src-supplier=Digi-Key; ComponentLink9Description: https://datasheet.ciiva.com/2493/pyu-r-int-thick-7-2493813.pdf?src-supplier=Digi-Key; ComponentLink10URL: https://datasheet.ciiva.com/2493/pyu-r-int-thick-7-2493811.pdf?src-supplier=Digi-Key; ComponentLink10Description: https://datasheet.ciiva.com/2493/pyu-r-int-thick-7-2493811.pdf?src-supplier=Digi-Key; ComponentLink11URL: https://datasheet.ciiva.com/8892/pyu-rc0201-51-rohs-l-8-8892942.pdf?src-supplier=Avnet; ComponentLink11Description: https://datasheet.ciiva.com/8892/pyu-rc0201-51-rohs-l-8-8892942.pdf?src-supplier=Avnet; Supplier 1: Digi-Key; Supplier Part Number 1: 311-4.70KMCT-ND; Stock 1: 6149397; Pricing 1: 1=0,10000, 10=0,03700, 100=0,01530, 1000=0,00685, 2500=0,00595, 5000=0,00491 (USD); RoHS: Yes; Case/Package: 0201; Case Code (Metric): 0603; Case Code (Imperial): 0201; Weight: 6E-06oz; Contact Plating: Tin,Matte; Size Code: 0201; Min Operating Temperature: -55°C; Max Operating Temperature: 125°C; Tolerance: 1%; Packaging: Tape and Reel; Package Quantity: 1; Resistor Type: Thick Film; Number of Terminations: 2; Termination: SMD/SMT; Max Power Dissipation: 50mW; Features: Moisture Resistant; Series: RC; Resistance Tolerance: 1%; Construction: Rectangular; Length: 0.6mm; Width: 0.012inch; Height: 0.01inch; Depth: 0.3mm; Radiation Hardening: No; Military Standard: Not; Lead Free: Lead Free; RoHS Compliant: Yes
R46 R47 = Res_0402: Part Description: 3 kOhms ±1% 0.05W, 1/20W Chip Resistor 0201 (0603 Metric) Moisture Resistant Thick Film; Manufacturer: Yageo; Manufacturer Part Number 1: RC0201FR-073KL; Resistance: 3kR; Max Power Dissipation: 50mW; Temperature Coefficient: 200ppm/°C; Value: 3k, 1%; Supplier 1: Digi-Key; Supplier Part Number 1: YAG2656CT-ND; Stock 1: 269780; Pricing 1: 1=0,10000, 10=0,03700, 100=0,01530, 1000=0,00685, 2500=0,00595, 5000=0,00491 (USD); RoHS: Yes; Case/Package: 0201; Case Code (Metric): 0603; Case Code (Imperial): 0201; Min Operating Temperature: -55°C; Max Operating Temperature: 125°C; Packaging: Tape and Reel; Resistor Type: Thick Film; Number of Terminations: 2; Tolerance: 1%; Features: Moisture Resistant; Length: 0.024inch; Width: 0.012inch; Height: 0.01inch; RoHS Compliant: Yes; ComponentLink1URL: http://www.yageo.com/documents/recent/PYu-RC_Group_51_RoHS_L_10.pdf?src-supplier=Digi-Key; ComponentLink1Description: http://www.yageo.com/documents/recent/PYu-RC_Group_51_RoHS_L_10.pdf?src-supplier=Digi-Key; ComponentLink2URL: http://www.yageo.com.tw/exep/pages/download/literatures/PYu-R_INT-thick_7.pdf?src-supplier=Digi-Key; ComponentLink2Description: http://www.yageo.com.tw/exep/pages/download/literatures/PYu-R_INT-thick_7.pdf?src-supplier=Digi-Key; ComponentLink3URL: http://www.yageo.com/documents/recent/PYu-RC_Group_51_RoHS_L_9.pdf?src-supplier=Digi-Key; ComponentLink3Description: http://www.yageo.com/documents/recent/PYu-RC_Group_51_RoHS_L_9.pdf?src-supplier=Digi-Key
R48 = Res_0402: Manufacturer: Yageo; Manufacturer Part Number 1: RC0201FR-071KL; Part Description: 1 kOhms ±1% 0.05W, 1/20W Chip Resistor 0201 (0603 Metric) Moisture Resistant Thick Film; Resistance: 1kR; Power Rating: 50mW; Voltage Rating: 25V; Temperature Coefficient: 200ppm/°C; Value: 1k, 1%; Supplier 1: Digi-Key; Supplier Part Number 1: 311-1KMDKR-ND; Stock 1: 9099863; Pricing 1: 1=0,10000, 10=0,03700, 100=0,01530, 1000=0,00685, 2500=0,00595, 5000=0,00491 (USD); RoHS: Yes; Case/Package: 0201; Case Code (Metric): 0603; Case Code (Imperial): 0201; Contact Plating: Tin,Matte; Min Operating Temperature: -55°C; Max Operating Temperature: 125°C; Package Quantity: 10000; Packaging: Tape and Reel; Tolerance: 1%; Resistor Type: Thick Film; Number of Terminations: 2; Termination: SMD/SMT; Max Power Dissipation: 50mW; Working Voltage: 25V; Features: Moisture Resistant; Series: RC; Resistance Tolerance: 1%; Technology: THICK FILM; Construction: Rectangular; Length: 0.024inch; Width: 0.012inch; Height: 0.01inch; Depth: 0.3mm; Radiation Hardening: No; Military Standard: Not; Lead Free: Lead Free; RoHS Compliant: Yes; ComponentLink1URL: https://datasheet.ciiva.com/7672/1563626-7672204.pdf?src-supplier=Element14; ComponentLink1Description: https://datasheet.ciiva.com/7672/1563626-7672204.pdf?src-supplier=Element14; ComponentLink2URL: https://datasheet.ciiva.com/22698/1563626-22698505.pdf?src-supplier=Element14; ComponentLink2Description: https://datasheet.ciiva.com/22698/1563626-22698505.pdf?src-supplier=Element14; ComponentLink3URL: https://datasheet.ciiva.com/29721/pyu-r-int-thick-7-29721196.pdf?src-supplier=Digi-Key; ComponentLink3Description: https://datasheet.ciiva.com/29721/pyu-r-int-thick-7-29721196.pdf?src-supplier=Digi-Key; ComponentLink4URL: https://datasheet.ciiva.com/29721/pyu-r-int-thick-7-29721195.pdf?src-supplier=Digi-Key; ComponentLink4Description: https://datasheet.ciiva.com/29721/pyu-r-int-thick-7-29721195.pdf?src-supplier=Digi-Key; ComponentLink5URL: https://datasheet.ciiva.com/8896/pyu-rc0201-51-rohs-l-8-8896174.pdf?src-supplier=Avnet; ComponentLink5Description: https://datasheet.ciiva.com/8896/pyu-rc0201-51-rohs-l-8-8896174.pdf?src-supplier=Avnet
R49-R51 = Res_0402: Part Description: 0 Ohms Jumper Chip Resistor 0201 (0603 Metric) Moisture Resistant Thick Film; Manufacturer: Yageo; Manufacturer Part Number 1: RC0201JR-070RL; Power Rating: 50mW; Tolerance: 5%; Voltage Rating: 25V; ComponentLink1URL: http://www.yageo.com/documents/recent/PYu-RC_Group_51_RoHS_L_7.pdf; ComponentLink1Description: http://www.yageo.com/documents/recent/PYu-RC_Group_51_RoHS_L_7.pdf; Value: 0R; Supplier 1: Digi-Key; Supplier Part Number 1: 311-0.0NCT-ND; Stock 1: 6252381; Pricing 1: 1=0,10000, 10=0,03700, 25=0,02680, 50=0,02020, 100=0,01500, 250=0,01140, 500=0,00912, 1000=0,00672, 5000=0,00482 (USD); RoHS: Yes; Case/Package: 0201; Case Code (Metric): 0603; Case Code (Imperial): 0201; Weight: 6E-06oz; Contact Plating: Tin,Matte; Size Code: 0201; Min Operating Temperature: -55°C; Max Operating Temperature: 125°C; Packaging: Tape and Reel; Resistance: 0R; Package Quantity: 1; Resistor Type: Thick Film; Number of Terminations: 2; Termination: SMD/SMT; Max Power Dissipation: 50mW; Voltage Rating (DC): 25V; Features: Moisture Resistant; Series: RC; Construction: Rectangular; Resistance Tolerance: 5%; Length: 0.024inch; Width: 0.012inch; Height: 0.01inch; Depth: 0.3mm; Radiation Hardening: No; Military Standard: Not; Lead Free: Lead Free; RoHS Compliant: Yes; ComponentLink2URL: https://datasheet.ciiva.com/7672/1563626-7672248.pdf?src-supplier=Element14; ComponentLink2Description: https://datasheet.ciiva.com/7672/1563626-7672248.pdf?src-supplier=Element14; ComponentLink3URL: https://datasheet.ciiva.com/7672/1563626-7672247.pdf?src-supplier=Element14; ComponentLink3Description: https://datasheet.ciiva.com/7672/1563626-7672247.pdf?src-supplier=Element14; ComponentLink4URL: https://datasheet.ciiva.com/7660/1421516-7660808.pdf?src-supplier=Element14; ComponentLink4Description: https://datasheet.ciiva.com/7660/1421516-7660808.pdf?src-supplier=Element14; ComponentLink5URL: https://datasheet.ciiva.com/46391/1421516-46391340.pdf?src-supplier=Element14; ComponentLink5Description: https://datasheet.ciiva.com/46391/1421516-46391340.pdf?src-supplier=Element14
TP1-TP3 = TESTPOINT_PAD: Test Point PCB mount Miniature White
X9 = Molex_0788641001_spring_contacts: Header, 6-pin; Part Description: 6 Position Spring Battery Contact Connector Surface Mount; Manufacturer Part Number 1: 78864-1001; Voltage Rating: 10V; Number of Contacts: 6; Glow Wire Compliant: Non-compliant; Supplier 1: Digi-Key; Supplier Part Number 1: WM11204CT-ND; Manufacturer: Molex; Stock 1: 133097; Pricing 1: 1=0,45000, 10=0,36500, 100=0,26730, 1000=0,21263 (USD); RoHS: Yes; Contact Material: Copper Alloy; Orientation: Vertical; Voltage Rating (DC): 10V; Number of Circuits: 6; Halogen Free: Low Halogen; ComponentLink1URL: http://www.farnell.com/datasheets/2216617.pdf?src-supplier=Farnell; ComponentLink1Description: http://www.farnell.com/datasheets/2216617.pdf?src-supplier=Farnell; ComponentLink2URL: http://www.farnell.com/datasheets/2216617.pdf?src-supplier=Newark; ComponentLink2Description: http://www.farnell.com/datasheets/2216617.pdf?src-supplier=Newark; ComponentLink3URL: http://www.farnell.com/datasheets/1862322.pdf?src-supplier=Element14; ComponentLink3Description: http://www.farnell.com/datasheets/1862322.pdf?src-supplier=Element14

## Sheet 09_Misc.SchDoc: Misc
size A3; Organization: Lime Microsystems; Address1: Surrey Tech Centre; Address2: Guildford GU2 7YG; Address3: Surrey; Address4: United Kingdom; Revision: v1.4; SheetNumber: 10; SheetTotal: 11
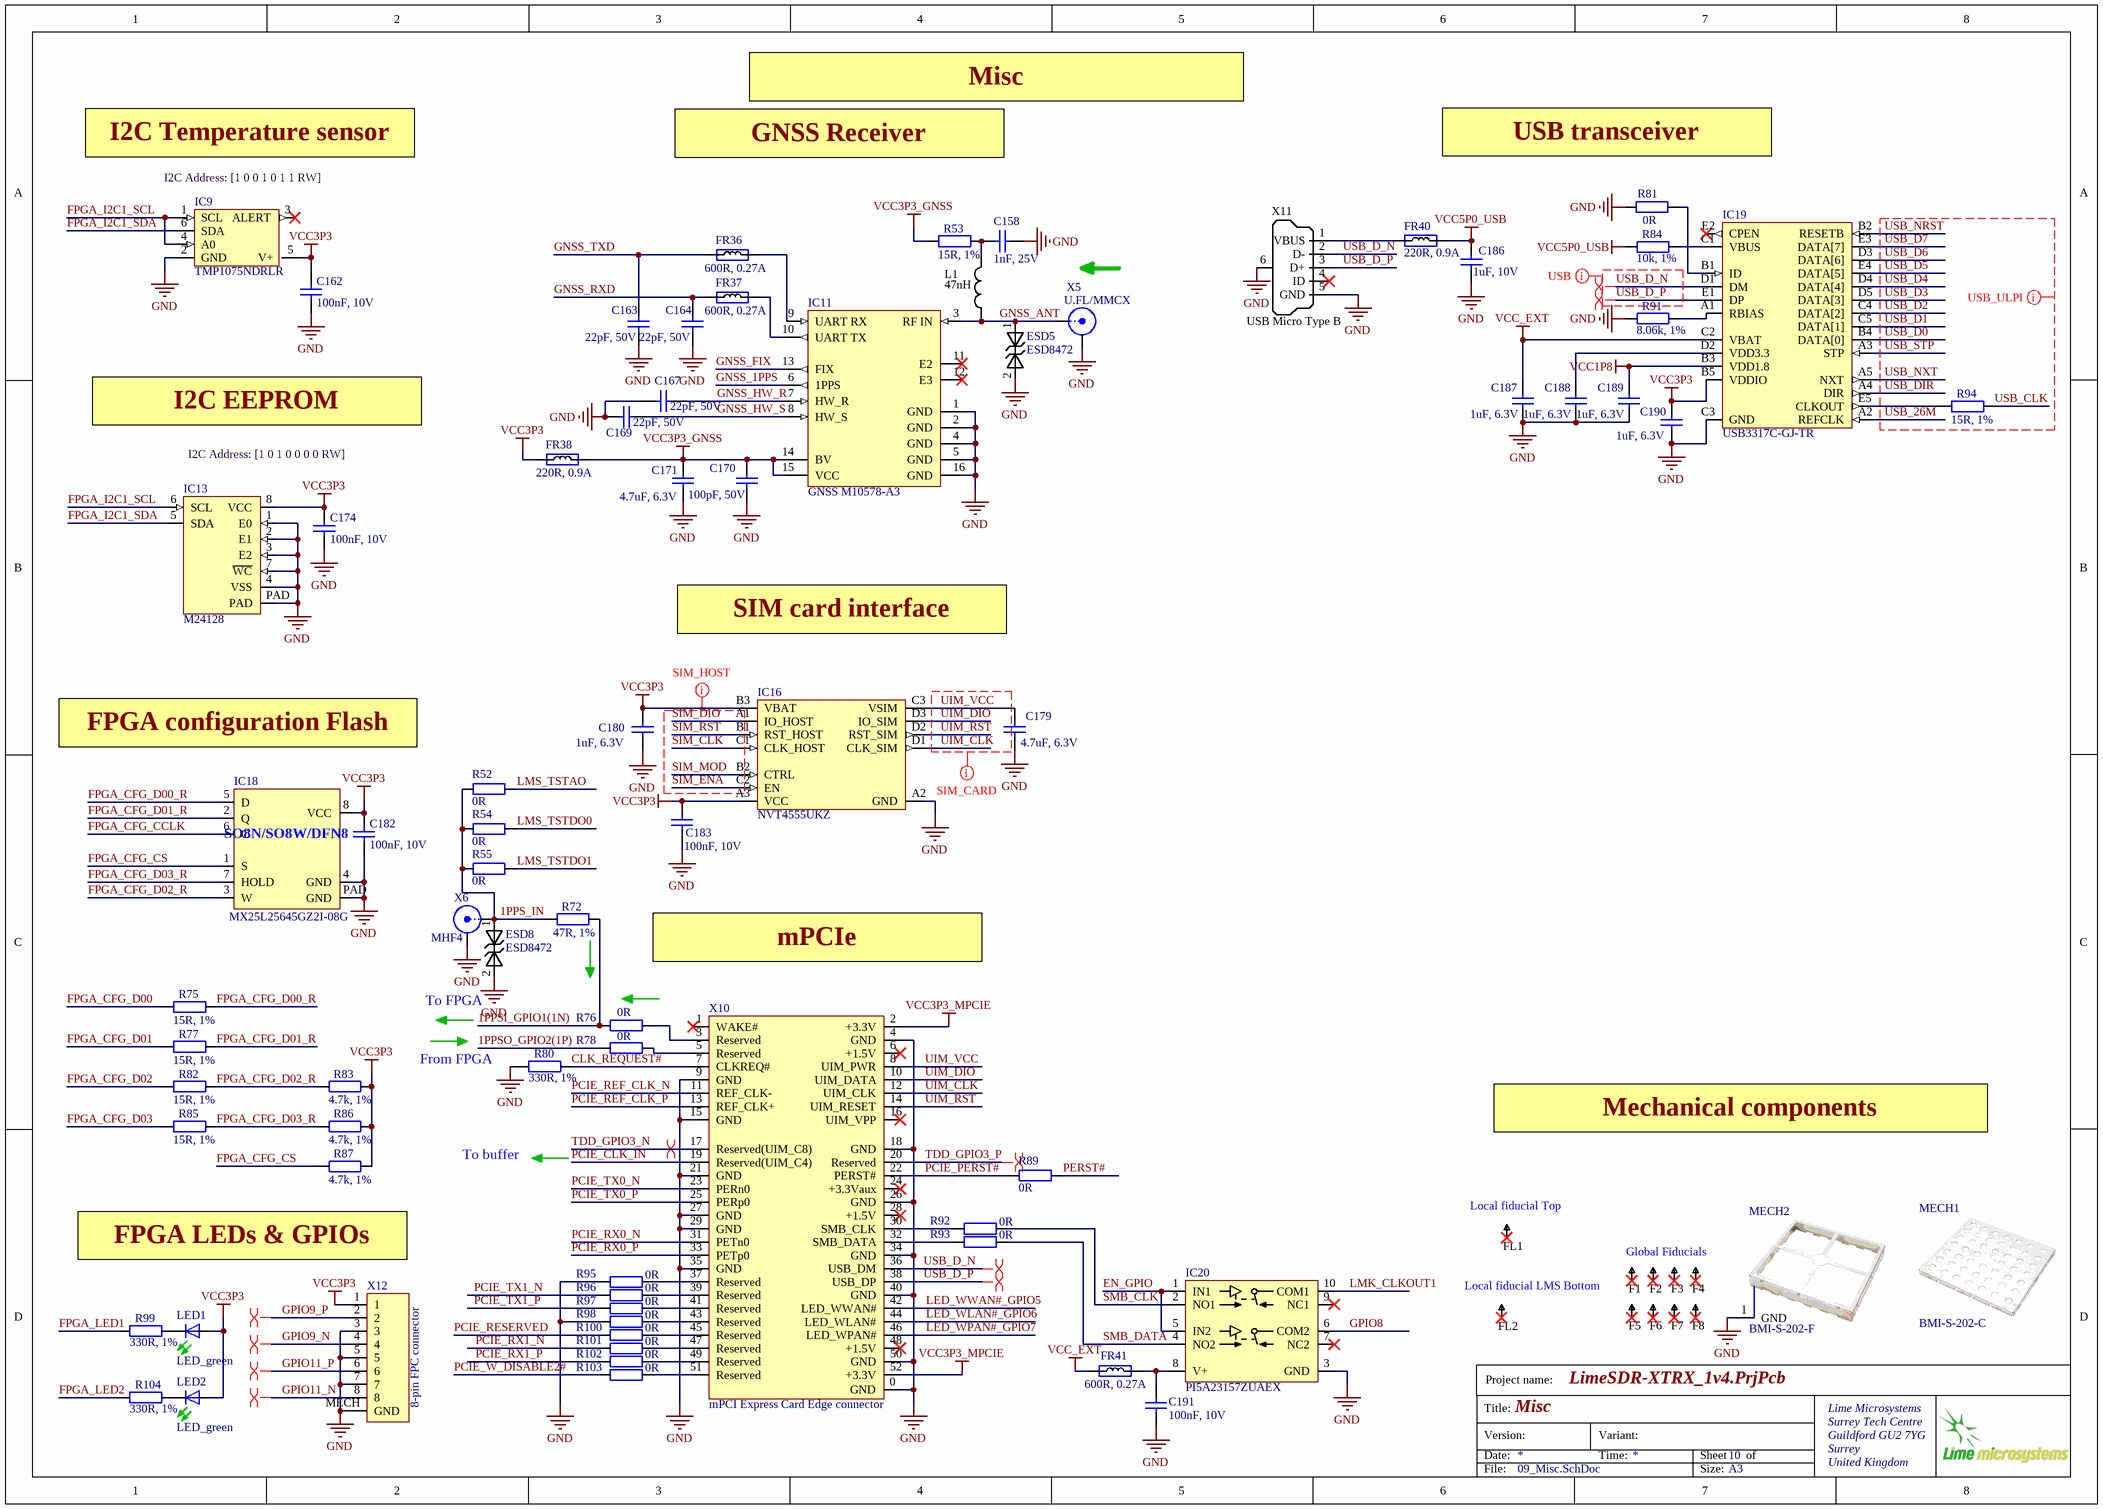
[diagram p8: 09_Misc.SchDoc]

### Parts
C158  1nF, 25V  [CAP0201]
C162  100nF, 10V  [CAP0201]
C163  22pF, 50V  [CAP0201]
C164  22pF, 50V  [CAP0201]
C167  22pF, 50V  [CAP0201]
C169  22pF, 50V  [CAP0201]
C170  100pF, 50V  [CAP0201]
C171  4.7uF, 6.3V  [CAP0402]
C174  100nF, 10V  [CAP0201]
C179  4.7uF, 6.3V  [CAP0402]
C180  1uF, 6.3V  [CAP0201]
C182  100nF, 10V  [CAP0201]
C183  100nF, 10V  [CAP0201]
C186  1uF, 10V  [CAP0402]
C187  1uF, 6.3V  [CAP0201]
C188  1uF, 6.3V  [CAP0201]
C189  1uF, 6.3V  [CAP0201]
C190  1uF, 6.3V  [CAP0201]
C191  100nF, 10V  [CAP0201]
ESD5  ESD8472  [ESD8472_X3DFN2]
ESD8  ESD8472  [ESD8472_X3DFN2]
F1  Fiducial  [Fiducial]  (value not drawn)
F2  Fiducial  [Fiducial]  (value not drawn)
F3  Fiducial  [Fiducial]  (value not drawn)
F4  Fiducial  [Fiducial]  (value not drawn)
F5  Fiducial  [Fiducial]  (value not drawn)
F6  Fiducial  [Fiducial]  (value not drawn)
F7  Fiducial  [Fiducial]  (value not drawn)
F8  Fiducial  [Fiducial]  (value not drawn)
FL1  Fiducial  [Fiducial_local]  (value not drawn)
FL2  Fiducial  [Fiducial_local]  (value not drawn)
FR36  600R, 0.27A  [RES0201]
FR37  600R, 0.27A  [RES0201]
FR38  220R, 0.9A  [RES0402]
FR40  220R, 0.9A  [RES0402]
FR41  600R, 0.27A  [RES0201]
IC9  TMP1075NDRLR  [TMP1075NDRLR_temperature_sensor_SOT563]
IC11  GNSS M10578-A3  [M10578-A3_v2]
IC13  M24128  [M24128-DFMC6TG]
IC16  NVT4555UKZ  [NVT4555UKZ_SIM_INTERFACE_WLCSP12]
IC18  MX25L25645GZ2I-08G  [S25FL164K_WSON8_DFN6]
IC19  USB3317C-GJ-TR  [USB3317C-GJ-TR_USB2_transceiver]
IC20  PI5A23157ZUAEX  [PI5A23157ZUAEX_SPDT_SW_10UQFN]
L1  47nH  [RES0402]
LED1  LED_green  [LED0201]
LED2  LED_green  [LED0201]
MECH1  BMI-S-202-C  [BMI-S-202-C_RF_SHIELD_COVER]
MECH2  BMI-S-202-F  [BMI-S-202-F_RF_SHIELD_FRAME_v3]
R52  0R  [RES0201]
R53  15R, 1%  [RES0201]
R54  0R  [RES0201]
R55  0R  [RES0201]
R72  47R, 1%  [RES0201]
R75  15R, 1%  [RES0201]
R76  0R  [RES0201]
R77  15R, 1%  [RES0201]
R78  0R  [RES0201]
R80  330R, 1%  [RES0201]
R81  0R  [RES0201]
R82  15R, 1%  [RES0201]
R83  4.7k, 1%  [RES0201]
R84  10k, 1%  [RES0201]
R85  15R, 1%  [RES0201]
R86  4.7k, 1%  [RES0201]
R87  4.7k, 1%  [RES0201]
R89  0R  [RES0201]
R91  8.06k, 1%  [RES0201]
R92  0R  [RES0201]
R93  0R  [RES0201]
R94  15R, 1%  [RES0201]
R95  0R  [RES0201]
R96  0R  [RES0201]
R97  0R  [RES0201]
R98  0R  [RES0201]
R99  330R, 1%  [RES0201]
R100  0R  [RES0201]
R101  0R  [RES0201]
R102  0R  [RES0201]
R103  0R  [RES0201]
R104  330R, 1%  [RES0201]
X5  U.FL/MMCX  [MMCX_UFL_conn_u_v2]
X6  MHF4  [IPEX_MHF4_conn]
X10  mPCI Express Card Edge connector  [PCIe_MiniCard]  (no BOM)
X11  USB Micro Type B  [USB_Micro_TypeB_47346-0001]
X12  8-pin FPC connector  [503480-0800_8PIN_FPC_CONN]

### Nets
GND: C158.2 C162.2 C163.2 C164.2 C167.2 C169.2 C170.1 C171.1 C174.2 C179.1 C180.2 C182.2 C183.2 C186.1 C187.2 C188.2 C189.2 C190.2 C191.2 ESD5.2 ESD8.2 IC9.2(GND) IC11.1(GND) IC11.2(GND) IC11.4(GND) IC11.5(GND) IC11.16(GND) IC13.1(E0) IC13.2(E1) IC13.3(E2) IC13.4(VSS) IC13.7(~{WC}) IC13.PAD IC16.A2(GND) IC18.4(GND) IC18.PAD(GND) IC19.C3(GND) IC20.3(GND) MECH2.1(GND) R80.2 R81.1 R91.2 R95.1 R98.1 X5.2(Y) X6.2(Y) X10.0(GND) X10.4(GND) X10.9(GND) X10.15(GND) X10.18(GND) X10.21(GND) X10.26(GND) X10.27(GND) X10.29(GND) X10.34(GND) X10.35(GND) X10.40(GND) X10.50(GND) X11.5(GND) X11.6(Shell) X12.3 X12.5 X12.7 X12.MECH(GND)
VCC1P8: C189.1 IC19.B3(VDD1.8)
VCC3P3: C162.1 C174.1 C180.1 C182.1 C183.1 C190.1 FR38.1 IC9.5(V+) IC13.8(VCC) IC16.A3(VCC) IC16.B3(VBAT) IC18.8(VCC) IC19.B5(VDDIO) LED1.A LED2.A R83.1 R86.1 R87.1 X12.1
VCC3P3_GNSS: C170.2 C171.2 FR38.2 IC11.14(BV) IC11.15(VCC) R53.2
VCC3P3_MPCIE: X10.2(+3.3V) X10.52(+3.3V)
VCC5P0_USB: C186.2 FR40.2 R84.2
VCC_EXT: C187.1 FR41.1 IC19.C2(VBAT)
1PPS_IN: ESD8.1 R52.1 R54.1 R55.1 R72.2 X6.1(X)
1PPSI_GPIO1(1N): R72.1 R76.1
1PPSO_GPIO2(1P): R78.1
CLK_REQUEST#: R80.1 X10.7(CLKREQ#)
EN_GPIO: IC20.1(IN1) IC20.5(IN2)
FPGA_CFG_CCLK: IC18.6(C)
FPGA_CFG_CS: IC18.1(S) R87.2
FPGA_CFG_D00: R75.2
FPGA_CFG_D00_R: IC18.5(D) R75.1
FPGA_CFG_D01: R77.2
FPGA_CFG_D01_R: IC18.2(Q) R77.1
FPGA_CFG_D02: R82.2
FPGA_CFG_D02_R: IC18.3(W) R82.1 R83.2
FPGA_CFG_D03: R85.2
FPGA_CFG_D03_R: IC18.7(HOLD) R85.1 R86.2
FPGA_I2C1_SCL: IC9.1(SCL) IC9.4(A0) IC13.6(SCL)
FPGA_I2C1_SDA: IC9.6(SDA) IC13.5(SDA)
FPGA_LED1: R99.2
FPGA_LED2: R104.2
GNSS_1PPS: IC11.6(1PPS)
GNSS_ANT: ESD5.1 IC11.3(RF_IN) L1.1 X5.1(X)
GNSS_FIX: IC11.13(FIX)
GNSS_HW_R: C167.1 IC11.7(HW_R)
GNSS_HW_S: C169.1 IC11.8(HW_S)
GNSS_RXD: C164.1 FR37.1
GNSS_TXD: C163.1 FR36.1
GPIO8: IC20.6(COM2)
GPIO9_N: X12.4
GPIO9_P: X12.2
GPIO11_N: X12.8
GPIO11_P: X12.6
LED_WLAN#_GPIO6: X10.44(LED_WLAN#)
LED_WPAN#_GPIO7: X10.46(LED_WPAN#)
LED_WWAN#_GPIO5: X10.42(LED_WWAN#)
LMK_CLKOUT1: IC20.10(COM1)
LMS_TSTAO: R52.2
LMS_TSTDO0: R54.2
LMS_TSTDO1: R55.2
PCIE_CLK_IN: X10.19(Reserved(UIM_C4))
PCIE_PERST#: R89.1 X10.22(PERST#)
PCIE_REF_CLK_N: X10.11(REF_CLK-)
PCIE_REF_CLK_P: X10.13(REF_CLK+)
PCIE_RESERVED: R100.1
PCIE_RX0_N: X10.31(PETn0)
PCIE_RX0_P: X10.33(PETp0)
PCIE_RX1_N: R101.1
PCIE_RX1_P: R102.1
PCIE_TX0_N: X10.23(PERn0)
PCIE_TX0_P: X10.25(PERp0)
PCIE_TX1_N: R96.1
PCIE_TX1_P: R97.1
PCIE_W_DISABLE2#: R103.1
PERST#: R89.2
SIM_CLK: IC16.C1(CLK_HOST)
SIM_DIO: IC16.A1(IO_HOST)
SIM_ENA: IC16.C2(EN)
SIM_MOD: IC16.B2(CTRL)
SIM_RST: IC16.B1(RST_HOST)
SMB_CLK: IC20.2(NO1) R92.2
SMB_DATA: IC20.4(NO2) R93.2
TDD_GPIO3_N: X10.17(Reserved(UIM_C8))
TDD_GPIO3_P: X10.20(Reserved)
UIM_CLK: IC16.D1(CLK_SIM) X10.12(UIM_CLK)
UIM_DIO: IC16.D3(IO_SIM) X10.10(UIM_DATA)
UIM_RST: IC16.D2(RST_SIM) X10.14(UIM_RESET)
UIM_VCC: C179.2 IC16.C3(VSIM) X10.8(UIM_PWR)
USB_26M: IC19.A2(REFCLK)
USB_CLK: R94.1
USB_D0: IC19.B4(DATA[0])
USB_D1: IC19.C5(DATA[1])
USB_D2: IC19.C4(DATA[2])
USB_D3: IC19.D5(DATA[3])
USB_D4: IC19.D4(DATA[4])
USB_D5: IC19.E4(DATA[5])
USB_D6: IC19.D3(DATA[6])
USB_D7: IC19.E3(DATA[7])
USB_D_N: IC19.D1(DM) X10.36(USB_DM) X11.2(D-)
USB_D_P: IC19.E1(DP) X10.38(USB_DP) X11.3(D+)
USB_DIR: IC19.A4(DIR)
USB_NRST: IC19.B2(RESETB)
USB_NXT: IC19.A5(NXT)
USB_STP: IC19.A3(STP)
NetC158_1: C158.1 L1.2 R53.1
NetC188_1: C188.1 IC19.D2(VDD3.3)
NetC191_1: C191.1 FR41.2 IC20.8(V+)
NetFR36_2: FR36.2 IC11.9(UART_RX)
NetFR37_2: FR37.2 IC11.10(UART_TX)
NetFR40_1: FR40.1 X11.1(VBUS)
NetIC19_A1: IC19.A1(RBIAS) R91.1
NetIC19_B1: IC19.B1(ID) R81.2
NetIC19_C1: IC19.C1(VBUS) R84.1
NetIC19_E5: IC19.E5(CLKOUT) R94.2
NetLED1_K: LED1.K(C) R99.1
NetLED2_K: LED2.K(C) R104.1
NetR76_2: R76.2 X10.3(Reserved)
NetR78_2: R78.2 X10.5(Reserved)
NetR92_1: R92.1 X10.30(SMB_CLK)
NetR93_1: R93.1 X10.32(SMB_DATA)
NetR95_2: R95.2 X10.37(Reserved)
NetR96_2: R96.2 X10.39(Reserved)
NetR97_2: R97.2 X10.41(Reserved)
NetR98_2: R98.2 X10.43(Reserved)
NetR100_2: R100.2 X10.45(Reserved)
NetR101_2: R101.2 X10.47(Reserved)
NetR102_2: R102.2 X10.49(Reserved)
NetR103_2: R103.2 X10.51(Reserved)

Not connected (* = marked no-connect by the designer): F1 1*; F2 1*; F3 1*; F4 1*; F5 1*; F6 1*; F7 1*; F8 1*; FL1 1*; FL2 1*; IC9 3(ALERT)*; IC11 11(E2)* 12(E3)*; IC19 E2(CPEN)*; IC20 7(NC2)* 9(NC1)*; X10 1(WAKE#)* 6(+1.5V)* 16(UIM_VPP)* 24(+3.3Vaux)* 28(+1.5V)* 48(+1.5V)*; X11 4(ID)*

### Layout directives
net class SIM_HOST: SIM_CLK, SIM_DIO, SIM_ENA, SIM_MOD, SIM_RST
net class SIM_CARD: UIM_CLK, UIM_DIO, UIM_RST, UIM_VCC
differential pair: GPIO9_N, GPIO9_P, GPIO11_N, GPIO11_P, TDD_GPIO3_N, TDD_GPIO3_P, USB_D_N, USB_D_P
net class USB: USB_D_N, USB_D_P
net class USB_ULPI: USB_26M, USB_CLK, USB_D0, USB_D1, USB_D2, USB_D3, USB_D4, USB_D5, USB_D6, USB_D7, USB_DIR, USB_NRST, USB_NXT, USB_STP

### Notes on the sheet
- Misc
- I2C Temperature sensor
- (near IC9) I2C Address: [1 0 0 1 0 1 1 RW]
- GNSS Receiver
- USB transceiver
- I2C EEPROM
- I2C Address: [1 0 1 0 0 0 0 RW]
- SIM card interface
- FPGA configuration Flash
- mPCIe
- (near ESD8) To FPGA
- From FPGA
- Mechanical components
- To buffer
- FPGA LEDs & GPIOs
- (near FL1) Local fiducial Top
- Global Fiducials
- Local fiducial LMS Bottom
- Project name:
- Title:
- Version:
- Date:
- Variant:
- Time:
- Sheet
- of
- File:
- Size:
- A3
- (in symbol M25P40_with_pad) SO8N/SO8W/DFN8